# EAGLE design Power PCB_v2 (EAGLE 9.6.2)
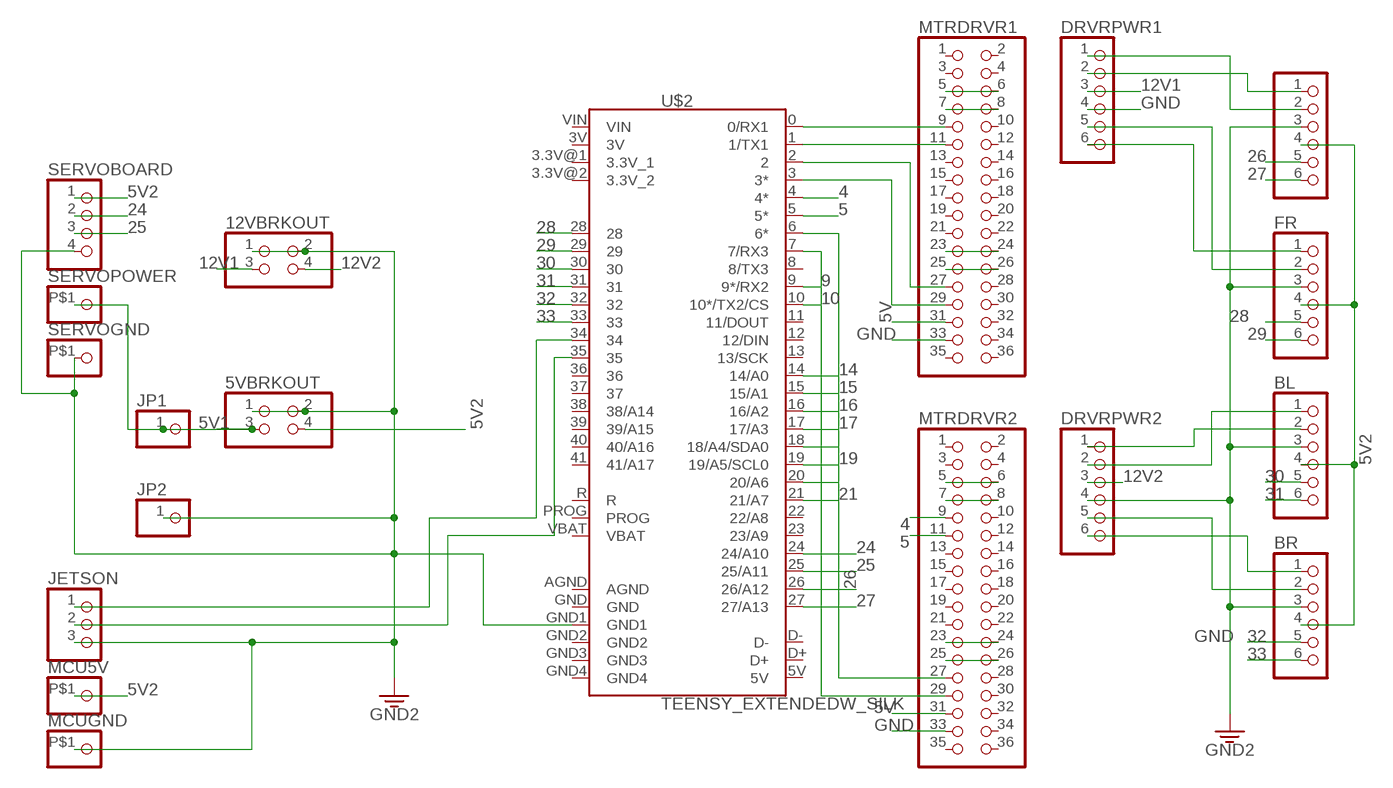
[diagram p0: schematic, sheet 1]

## Parts
5VBRKOUT  PINHD-2X2  [2X02]
12VBRKOUT  PINHD-2X2  [2X02]
BL  PINHD-1X6  [1X06]
BR  PINHD-1X6  [1X06]
DRVRPWR1  PINHD-1X6-3.5MM  [1X06-3.5MM]
DRVRPWR2  PINHD-1X6-3.5MM  [1X06-3.5MM]
FL  PINHD-1X6  [1X06]
FR  PINHD-1X6  [1X06]
JETSON  PINHD-1X3  [1X03]
JP1  PINHD-1X1  [1X01]
JP2  PINHD-1X1  [1X01]
MCU5V  PINHD-1X1-BIGPOGO  [1X1-BIGPOGO]
MCUGND  PINHD-1X1-BIGPOGO  [1X1-BIGPOGO]
MTRDRVR1  PINHD-2X18  [2X18]
MTRDRVR2  PINHD-2X18  [2X18]
SERVOBOARD  PINHD-1X4  [1X04]
SERVOGND  PINHD-1X1-BIGPOGO  [1X1-BIGPOGO]
SERVOPOWER  PINHD-1X1-BIGPOGO  [1X1-BIGPOGO]
U$2  TEENSY_EXTENDEDW_SILK  [TEENSY_EXTENDED]

## Nets
4: MTRDRVR2.9 U$2.4(4*)
5: MTRDRVR2.11 U$2.5(5*)
5V: MTRDRVR1.31 MTRDRVR2.31
5V1: 5VBRKOUT.3 JP1.1 SERVOPOWER.P$1
5V2: 5VBRKOUT.4 BL.4 BR.4 FL.4 FR.4 MCU5V.P$1 SERVOBOARD.1
9: U$2.9(9*/RX2)
10: U$2.10(10*/TX2/CS)
12V1: 12VBRKOUT.3 DRVRPWR1.3
12V2: 12VBRKOUT.4 DRVRPWR2.3
14: U$2.14(14/A0)
15: U$2.15(15/A1)
16: U$2.16(16/A2)
17: U$2.17(17/A3)
18: U$2.18(18/A4/SDA0)
19: U$2.19(19/A5/SCL0)
20: U$2.20(20/A6)
21: U$2.21(21/A7)
24: SERVOBOARD.2 U$2.24(24/A10)
25: SERVOBOARD.3 U$2.25(25/A11)
26: FL.5 U$2.26(26/A12)
27: FL.6 U$2.27(27/A13)
28: FR.5 U$2.28
29: FR.6 U$2.29
30: BL.5 U$2.30
31: BL.6 U$2.31
32: BR.5 U$2.32
33: BR.6 U$2.33
GND: 5VBRKOUT.1 5VBRKOUT.2 12VBRKOUT.1 12VBRKOUT.2 BL.3 BR.3 DRVRPWR1.4 DRVRPWR2.4 FL.3 FR.3 JETSON.3 JP2.1 MCUGND.P$1 MTRDRVR1.5 MTRDRVR1.6 MTRDRVR1.33 MTRDRVR2.33 SERVOBOARD.4 SERVOGND.P$1 U$2.GND1 ; supply symbol labelled GND2
GND4: MTRDRVR2.5 MTRDRVR2.6
N$1: DRVRPWR1.2 FL.1
N$2: MTRDRVR1.9 U$2.0(0/RX1)
N$3: MTRDRVR2.7 MTRDRVR2.8
N$4: MTRDRVR1.7 MTRDRVR1.8
N$5: DRVRPWR1.1 FL.2
N$6: MTRDRVR1.11 U$2.1(1/TX1)
N$7: MTRDRVR1.23 MTRDRVR1.24
N$8: MTRDRVR2.25 MTRDRVR2.26
N$9: MTRDRVR1.29 U$2.3(3*)
N$10: MTRDRVR2.23 MTRDRVR2.24
N$11: JETSON.1 U$2.34
N$12: DRVRPWR1.5 FR.2
N$13: DRVRPWR1.6 FR.1
N$14: MTRDRVR1.27 U$2.2
N$15: BL.1 DRVRPWR2.2
N$16: BL.2 DRVRPWR2.1
N$17: BR.1 DRVRPWR2.6
N$18: BR.2 DRVRPWR2.5
N$19: MTRDRVR1.25 MTRDRVR1.26
N$21: JETSON.2 U$2.35
N$22: MTRDRVR2.27 U$2.6(6*)
N$23: MTRDRVR2.29 U$2.7(7/RX3)
Unconnected: MTRDRVR1.1 MTRDRVR1.2 MTRDRVR1.3 MTRDRVR1.4 MTRDRVR1.10 MTRDRVR1.12 MTRDRVR1.13 MTRDRVR1.14 MTRDRVR1.15 MTRDRVR1.16 MTRDRVR1.17 MTRDRVR1.18 MTRDRVR1.19 MTRDRVR1.20 MTRDRVR1.21 MTRDRVR1.22 MTRDRVR1.28 MTRDRVR1.30 MTRDRVR1.32 MTRDRVR1.34 MTRDRVR1.35 MTRDRVR1.36 MTRDRVR2.1 MTRDRVR2.2 MTRDRVR2.3 MTRDRVR2.4 MTRDRVR2.10 MTRDRVR2.12 MTRDRVR2.13 MTRDRVR2.14 MTRDRVR2.15 MTRDRVR2.16 MTRDRVR2.17 MTRDRVR2.18 MTRDRVR2.19 MTRDRVR2.20 MTRDRVR2.21 MTRDRVR2.22 MTRDRVR2.28 MTRDRVR2.30 MTRDRVR2.32 MTRDRVR2.34 MTRDRVR2.35 MTRDRVR2.36 U$2.8(8/TX3) U$2.11(11/DOUT) U$2.12(12/DIN) U$2.13(13/SCK) U$2.22(22/A8) U$2.23(23/A9) U$2.36 U$2.37 U$2.38(38/A14) U$2.39(39/A15) U$2.40(40/A16) U$2.41(41/A17) U$2.GND4 U$2.PROG U$2.R

## Power pins joined to a net without a drawn wire
3.3V_1: U$2.3.3V@1(3.3V_1)
3.3V_2: U$2.3.3V@2(3.3V_2)
3V: U$2.3V
5V: U$2.5V
AGND: U$2.AGND
D+: U$2.D+
D-: U$2.D-
GND: U$2.GND
GND2: U$2.GND2
GND3: U$2.GND3
VBAT: U$2.VBAT
VIN: U$2.VIN

## Library data of the parts
5VBRKOUT 12VBRKOUT = pinhead:PINHD-2X2: PIN HEADER
BL BR DRVRPWR1 DRVRPWR2 FL FR = adafruit:PINHD-1X6: PIN HEADER
JETSON = adafruit:PINHD-1X3: PIN HEADER
JP1 JP2 MCU5V MCUGND SERVOGND SERVOPOWER = adafruit:PINHD-1X1: Pin header 1x1 for 0.1" spacing With round pins
MTRDRVR1 MTRDRVR2 = pinhead:PINHD-2X18: PIN HEADER
SERVOBOARD = pinhead:PINHD-1X4: PIN HEADER
U$2 = SparkFun-Boards:TEENSY_EXTENDED: Teensy Footprint Extended Mechanical footprint with connectors for Teensy Development Board with ARM Cortex. SparkFun Products: Teensy 4.1 <https://www.sparkfun.com/products/16771> Teensy 3.6 <https://www.sparkfun.com/products/14057> Teensy 3.5 <https://www.sparkfun.com/products/14055> SparkFun Qwiic Shield for Teensy Extended <https://www.sparkfun.com/products/17156> Teensy Stackable Header Kit (Longer Version) <https://www.sparkfun.com/products/17152>

## Board
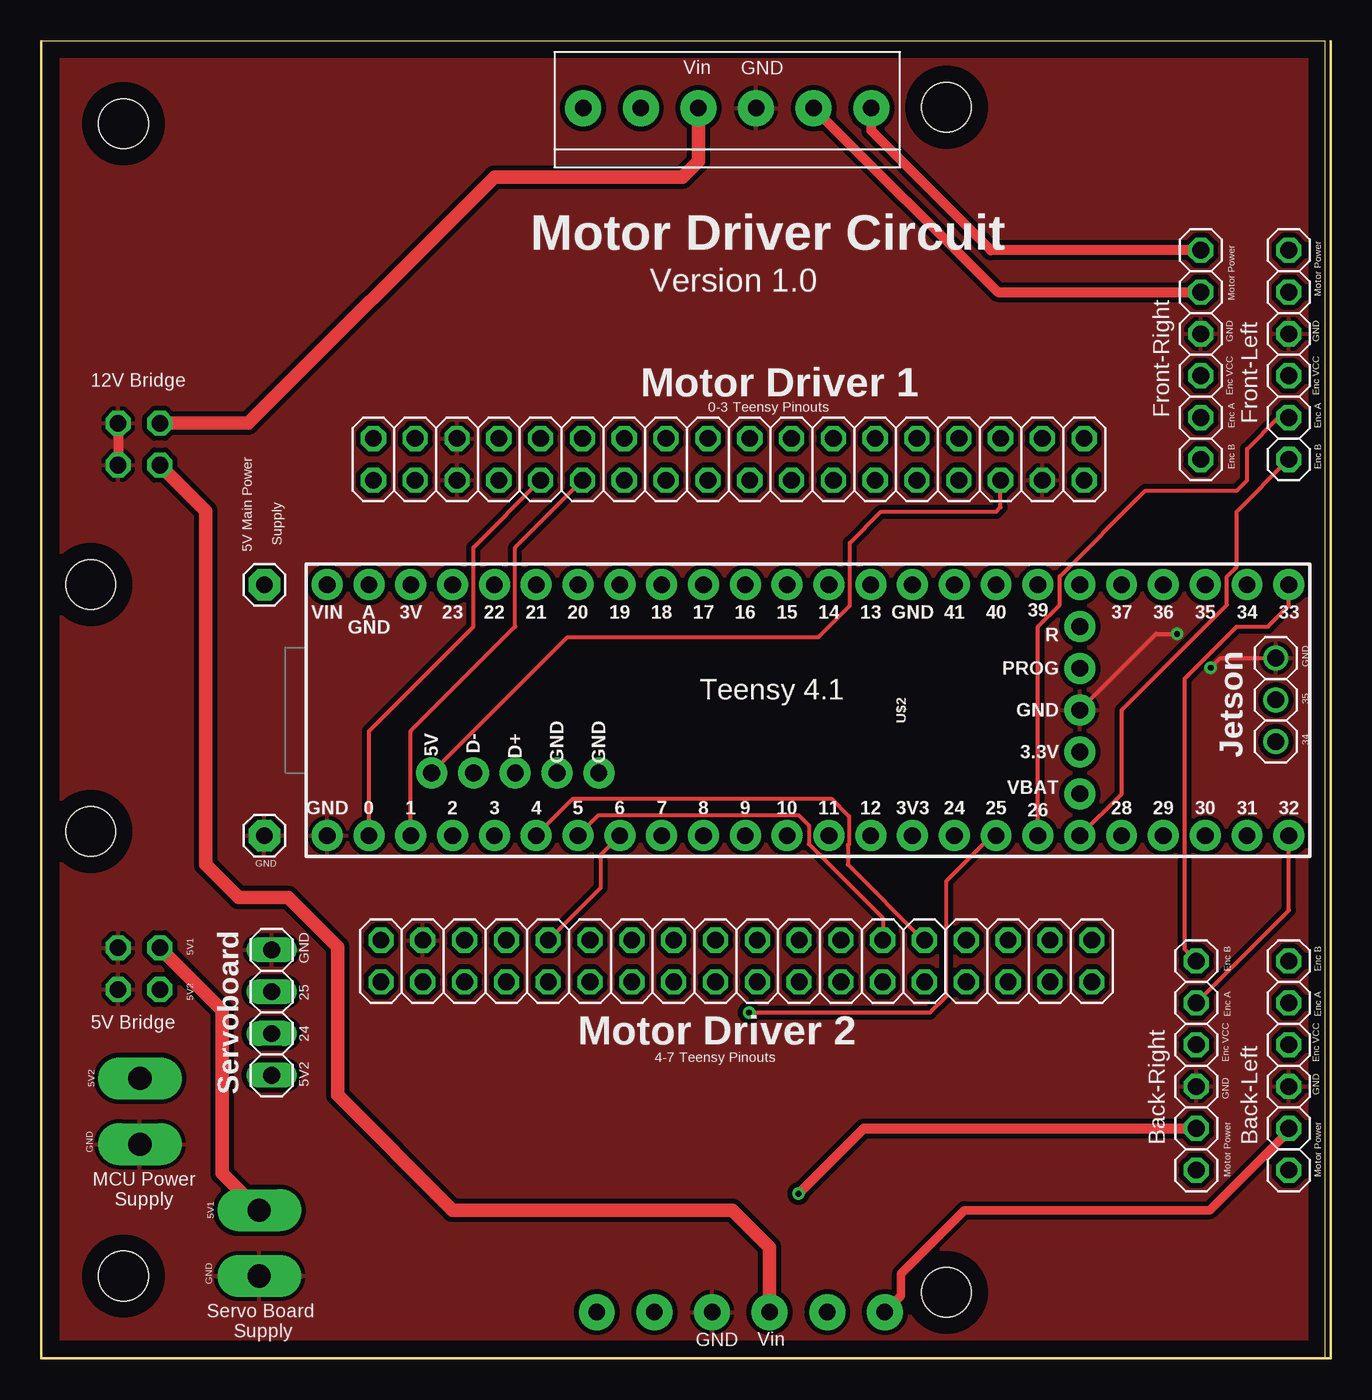
[diagram p1: board, top side]
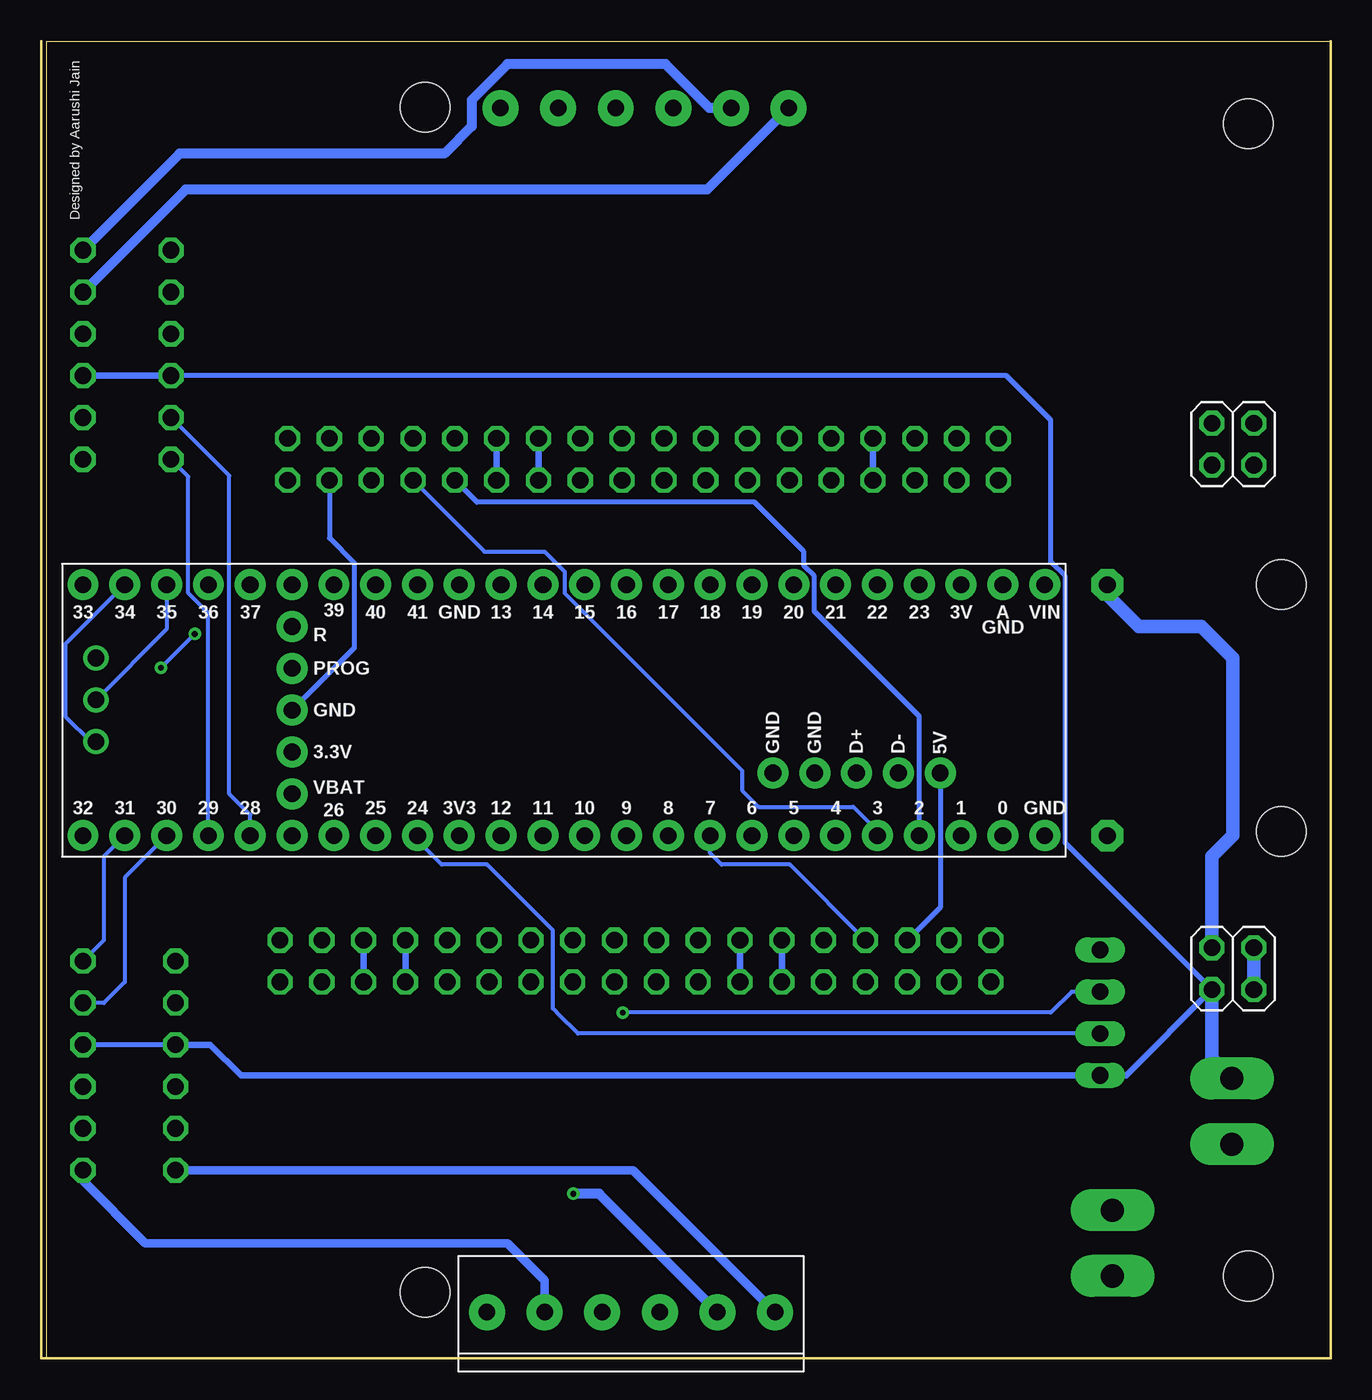
[diagram p2: board, bottom side, seen from below]

Size 78.33 x 80.01 mm. Coordinates in mm from the lower left corner, seen from the top.
Outline: 0,0 78,0 78,80 0,80 0,0
Outline: 0,0 78.33,0 78.33,80.01
Copper layers (1*16): Top 0.035mm / dielectric 1.5mm / Bottom 0.035mm
Design rules "default": minimum track width 6mil, minimum drill 0.35mm, track to track 6mil, track to pad 6mil, pad to pad 6mil, via to via 6mil, smd to smd 6mil, copper to edge 40mil, drill to drill 6mil, minimum pad ring 10mil, minimum via ring 8mil, stop-mask expansion 4mil, vias tented up to drill 0mil, thermal gap 10mil
Holes 3 mm at 5,75 5,5 55,76 55,4 3,47 3,32

### Footprints (pad centres in the part's own frame; a part is rotated, then mirrored left to right if it is on the bottom)
2X02 = drill 1.016 octagon: 1 -1.27,-1.27; 2 -1.27,1.27; 3 1.27,-1.27; 4 1.27,1.27
1X06 = drill 1.016 octagon: 1 -6.35,0; 2 -3.81,0; 3 -1.27,0; 4 1.27,0; 5 3.81,0; 6 6.35,0
1X06-3.5MM = drill 1 pad 2.184: 1 -8.75,0; 2 -5.25,0; 3 -1.75,0; 4 1.75,0; 5 5.25,0; 6 8.75,0
1X03 = drill 1.016: 1 -2.54,0; 2 0,0; 3 2.54,0
1X01 = drill 1.016 pad 1.93 octagon: 1 0,0
1X1-BIGPOGO = drill 1.4 pad 2.54 long: P$1 0,0
2X18 = drill 1.016 octagon: 1 -21.59,-1.27; 2 -21.59,1.27; 3 -19.05,-1.27; 4 -19.05,1.27; 5 -16.51,-1.27; 6 -16.51,1.27; 7 -13.97,-1.27; 8 -13.97,1.27; 9 -11.43,-1.27; 10 -11.43,1.27; 11 -8.89,-1.27; 12 -8.89,1.27; 13 -6.35,-1.27; 14 -6.35,1.27; 15 -3.81,-1.27; 16 -3.81,1.27; 17 -1.27,-1.27; 18 -1.27,1.27; 19 1.27,-1.27; 20 1.27,1.27; 21 3.81,-1.27; 22 3.81,1.27; 23 6.35,-1.27; 24 6.35,1.27; 25 8.89,-1.27; 26 8.89,1.27; 27 11.43,-1.27; 28 11.43,1.27; 29 13.97,-1.27; 30 13.97,1.27; 31 16.51,-1.27; 32 16.51,1.27; 33 19.05,-1.27; 34 19.05,1.27; 35 21.59,-1.27; 36 21.59,1.27
1X04 = drill 1.016 long: 1 -3.81,0; 2 -1.27,0; 3 1.27,0; 4 3.81,0
TEENSY_EXTENDED = drill 1.016 pad 1.88: 0 7.62,-13.97; 1 7.62,-11.43; 2 7.62,-8.89; 3 7.62,-6.35; 3.3V@1 7.62,19.05; 3.3V@2 2.54,29.21; 3V -7.62,-11.43; 4 7.62,-3.81; 5 7.62,-1.27; 5V 3.81,-10.16; 6 7.62,1.27; 7 7.62,3.81; 8 7.62,6.35; 9 7.62,8.89; 10 7.62,11.43; 11 7.62,13.97; 12 7.62,16.51; 13 -7.62,16.51; 14 -7.62,13.97; 15 -7.62,11.43; 16 -7.62,8.89; 17 -7.62,6.35; 18 -7.62,3.81; 19 -7.62,1.27; 20 -7.62,-1.27; 21 -7.62,-3.81; 22 -7.62,-6.35; 23 -7.62,-8.89; 24 7.62,21.59; 25 7.62,24.13; 26 7.62,26.67; 27 7.62,29.21; 28 7.62,31.75; 29 7.62,34.29; 30 7.62,36.83; 31 7.62,39.37; 32 7.62,41.91; 33 -7.62,41.91; 34 -7.62,39.37; 35 -7.62,36.83; 36 -7.62,34.29; 37 -7.62,31.75; 38 -7.62,29.21; 39 -7.62,26.67; 40 -7.62,24.13; 41 -7.62,21.59; AGND -7.62,-13.97; D+ 3.81,-5.08; D- 3.81,-7.62; GND 0,29.21; GND1 7.62,-16.51; GND2 -7.62,19.05; GND3 3.81,-2.54; GND4 3.81,0; PROG -2.54,29.21; R -5.08,29.21; VBAT 5.08,29.21; VIN -7.62,-16.51

### Placement (x,y rotation side)
5VBRKOUT  5.94,23.67 180 bottom
12VBRKOUT  5.94,55.53 180 bottom
BL  75.79,17.78 90 top
BR  70.17,17.78 90 top
DRVRPWR1  41.67,75.95 0 top
DRVRPWR2  42.5,2.81 0 bottom
FL  75.79,60.96 270 top
FR  70.44,60.96 270 top
JETSON  75,40 90 top
JP1  13.56,46.99 0 top
JP2  13.56,31.75 0 top
MCU5V  6,17 0 top
MCUGND  6,13 0 top
MTRDRVR1  41.77,54.61 0 top
MTRDRVR2  42.23,24.13 180 top
SERVOBOARD  14,21 90 top
SERVOGND  13.25,5 0 top
SERVOPOWER  13.25,9 0 top
U$2  33.88,39.37 270 top

### Tracks (layer width: path | path; a pad name or v marks a point on that pad's centre or on a via)
4
  Top 0.254: U$2.4 32.32,34 48,34 49.07,32.93 49.07,31.25 49,31.18 49,30 53.6,25.4 MTRDRVR2.9
5
  Top 0.254: U$2.5 33.86,33 46,33 46.63,32.37 46.63,31.25 51.12,26.76 MTRDRVR2.11
5V
  Top 0.254: U$2.5V 31.98,43.81 47.22,43.81 49.12,45.72 49.12,49.53 51.03,51.44 58.01,51.44 58.28,51.7 MTRDRVR1.31
  Bottom 0.305: U$2.5V 23.72,27.4 MTRDRVR2.31
5V1
  Top 0.813: 5VBRKOUT.3 11,21.15 11,11.25 SERVOPOWER.P$1
  Bottom 0.813: 5VBRKOUT.3 7.21,30.48 5.94,31.75 5.94,42.55 7.84,44.45 11.66,44.45 13.56,46.35 JP1.1
5V2
  Bottom 0.305: BR.4 BL.4 | 5VBRKOUT.4 16.12,31.32 16.12,47.51 17,48.38 17,57 19.69,59.69 FR.4
  Bottom 0.406: FR.4 FL.4 | BR.4 68.05,19.05 66.19,17.19 SERVOBOARD.1 13,17.19 12.42,17.19 5VBRKOUT.4
  Bottom 0.813: 5VBRKOUT.4 7.21,18.21 MCU5V.P$1
12V1
  Top 0.813: 12VBRKOUT.3 12.58,56.8 27.53,71.75 38.96,71.75 39.92,72.72 DRVRPWR1.3
12V2
  Top 0.813: 12VBRKOUT.4 10,51.47 10,30 12,28 15,28 18,25 18,16 25,9 42,9 44.25,6.75 DRVRPWR2.3
24
  Bottom 0.254: SERVOBOARD.2 45.73,19.73 46.88,20.88 47,21 47.25,21.25 47.25,26 51.25,30 54,30 55.47,31.47 U$2.24
25  (via drill 0.35)
  Top 0.254: v43,21 54,21 55,22 55,29 57.75,31.75 U$2.25
  Bottom 0.254: SERVOBOARD.3 15.73,22.27 17,21 v43,21
26
  Top 0.254: U$2.26 60.55,44.45 61.87,45.77 61.87,47 61.87,47.49 67.08,52.7 72.61,52.7 73.25,53.34 73.25,55.24 75.16,57.15 FL.5
27
  Top 0.254: U$2.27 65.63,34.29 65.63,39.37 72.03,45.77 72.03,47.49 72.61,48.08 72.61,51.44 FL.6
28
  Bottom 0.254: U$2.28 65.63,33.02 66.9,34.29 66.9,53.61 FR.5
29
  Bottom 0.254: FR.6 69.39,53.56 69.39,46.48 68.17,45.27 U$2.29
30
  Bottom 0.254: U$2.30 73.25,29.21 73.25,22.86 74.52,21.59 BL.5
31
  Bottom 0.254: U$2.31 74.52,30.48 74.52,25.4 BL.6
32
  Top 0.254: BR.5 75.79,27.21 U$2.32
33
  Top 0.254: BR.6 69.44,24.86 69.44,41.27 72.61,44.45 74.52,44.45 75.79,45.72 U$2.33
GND  (via drill 0.35)
  Top 0.254: U$2.GND 67.72,44 v69,44 | v71.05,41.95 71.64,42.54 JETSON.3
  Top 0.61: 12VBRKOUT.1 12VBRKOUT.2
  Bottom 0.254: v69,44 v71.05,41.95
  Bottom 0.305: MTRDRVR1.33 60.82,49.82 59.31,48.3 59.31,43.16 U$2.GND
  Bottom 0.813: 5VBRKOUT.1 5VBRKOUT.2
  pour Top (isolate 0.3): 0,0 0,80 78,80 78,0
GND4
  Bottom 0.406: MTRDRVR2.5 MTRDRVR2.6
N$1
  Bottom 0.61: DRVRPWR1.2 37.73,75.95 40.4,78.61 50,78.61 52.18,76.44 52.18,74.83 53.83,73.18 69.92,73.18 FL.1
N$2
  Top 0.254: U$2.0 19.91,38.1 26.26,44.45 26.26,49.26 MTRDRVR1.9
N$3
  Bottom 0.406: MTRDRVR2.7 MTRDRVR2.8
N$4
  Bottom 0.406: MTRDRVR1.7 MTRDRVR1.8
N$5
  Bottom 0.61: DRVRPWR1.1 37.87,71 69.56,71 FL.2
N$6
  Top 0.254: U$2.1 22.45,38.1 28.8,44.45 28.8,49.26 MTRDRVR1.11
N$7
  Bottom 0.406: MTRDRVR1.23 MTRDRVR1.24
N$8
  Bottom 0.406: MTRDRVR2.25 MTRDRVR2.26
N$9
  Bottom 0.254: MTRDRVR1.29 51.4,49 47.75,49 46.53,47.78 46.53,46.48 35.75,35.71 35.75,34.5 34.75,33.5 29,33.5 27.53,32.03 U$2.3
N$10
  Bottom 0.406: MTRDRVR2.23 MTRDRVR2.24
N$11
  Bottom 0.254: U$2.34 76.86,43.38 76.86,39 75.32,37.46 JETSON.1
N$12
  Top 0.61: DRVRPWR1.5 58.1,64.77 FR.2
N$13
  Top 0.61: FR.1 57.69,67.31 50.42,74.58 DRVRPWR1.6
N$14
  Bottom 0.305: U$2.2 24.99,38.99 31.37,45.37 31.37,47.51 32,48.14 32,49 35,52 51.86,52 MTRDRVR1.27
N$15
  Bottom 0.508: DRVRPWR2.2 47.75,4.75 50,7 72,7 75.79,10.79 BL.1
N$16
  Top 0.508: DRVRPWR2.1 52.23,3.79 52.23,5.15 56.08,9 71,9 75.79,13.79 BL.2
N$17
  Bottom 0.508: DRVRPWR2.6 42.37,11.43 BR.1
N$18  (via drill 0.35)
  Top 0.61: v46,10 49.97,13.97 BR.2
  Bottom 0.61: DRVRPWR2.5 44.44,10 v46,10
N$19
  Bottom 0.406: MTRDRVR1.25 MTRDRVR1.26
N$21
  Bottom 0.254: U$2.35 70.71,44.29 JETSON.2
N$22
  Top 0.254: MTRDRVR2.27 34,28.6 34,30.6 U$2.6
N$23
  Bottom 0.254: MTRDRVR2.29 32.86,30 37,30 37.69,30.69 U$2.7

### Text on the board
tPlace: Vin | GND | Motor Driver Circuit | Version 1.0 | Motor Power | Motor Power | GND | GND | 12V Bridge | Motor Driver 1 | 0-3 Teensy Pinouts | Enc VCC | Enc VCC | Front-Right | Front-Left | Enc A | Enc A | Enc B | Enc B | Supply | 5V Main Power | GND | Teensy 4.1 | Jetson | 35 | 34 | GND | 5V1 | GND | Enc B | Enc B | 5V2 | 25 | Servoboard | Enc A | Enc A | 5V Bridge | 24 | Motor Driver 2 | 4-7 Teensy Pinouts | Enc VCC | Enc VCC | 5V2 | 5V2 | GND | GND | Back-Right | Back-Left | GND | Motor Power | Motor Power | MCU Power / Supply | 5V1 | GND | Servo Board / Supply | Vin | GND
bPlace: Designed by Aarushi Jain